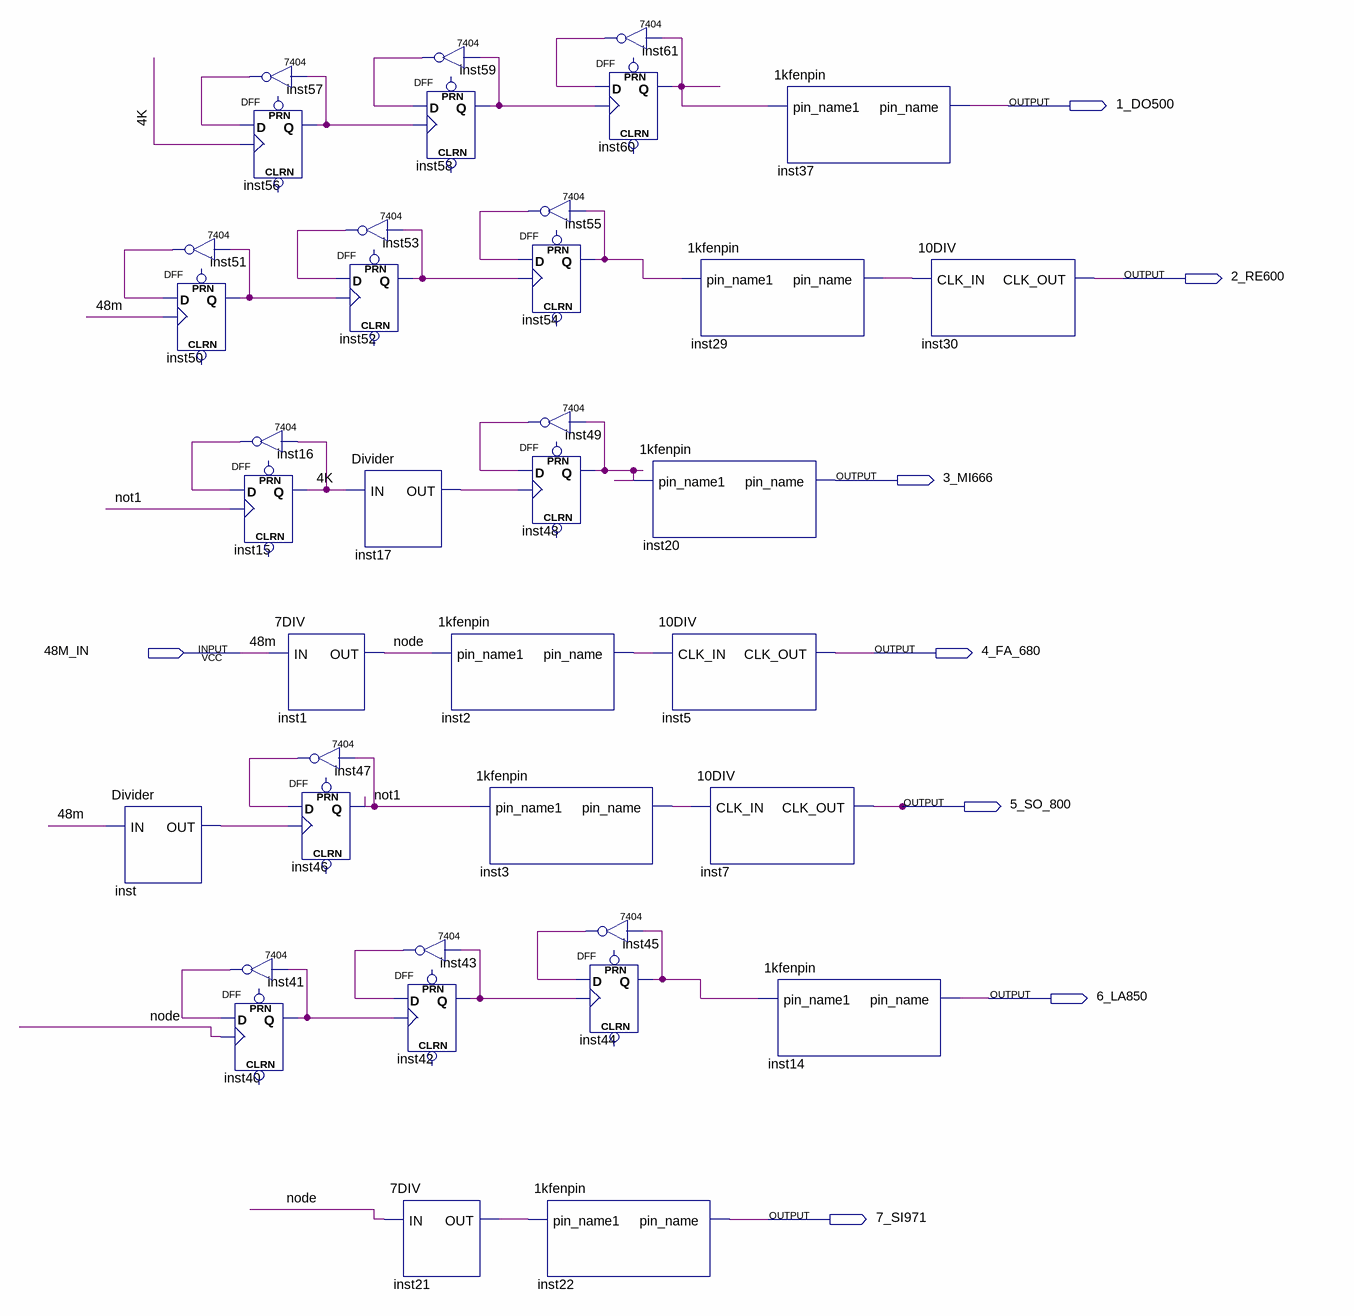
[diagram p0: schematic sheet]
// Quartus schematic MUSIC_TUNE.bdf as structural Verilog: 38 symbols, 8 pins
module MUSIC_TUNE (
  input  \48M_IN ,
  output \1_DO500 ,
  output \2_RE600 ,
  output \3_MI666 ,
  output \4_FA_680 ,
  output \5_SO_800 ,
  output \6_LA850 ,
  output \7_SI971 
);

  wire \4K , inst2_pin_name, inst3_pin_name, inst16_1, inst17_out, inst21_out, inst29_pin_name, inst40_q,
       inst41_1, inst42_q, inst43_1, inst44_q, inst45_1, inst47_1, inst48_q, inst49_1, inst50_q, inst51_1,
       inst52_q, inst53_1, inst54_q, inst55_1, inst56_q, inst57_1, inst58_q, inst59_1, inst60_q, inst61_1,
       inst_out, node, not1;

  Divider inst (.IN(\48M_IN ), .OUT(inst_out));
  \7404  inst51 (.\2 (inst50_q), .\1 (inst51_1));
  DFF inst50 (.CLK(\48M_IN ), .D(inst51_1), .Q(inst50_q));  // open: CLRN, PRN
  \7404  inst57 (.\2 (inst56_q), .\1 (inst57_1));
  DFF inst56 (.CLK(\4K ), .D(inst57_1), .Q(inst56_q));  // open: CLRN, PRN
  \7404  inst16 (.\2 (\4K ), .\1 (inst16_1));
  DFF inst15 (.CLK(not1), .D(inst16_1), .Q(\4K ));  // open: CLRN, PRN
  \7DIV  inst1 (.IN(\48M_IN ), .OUT(node));
  \7404  inst41 (.\2 (inst40_q), .\1 (inst41_1));
  DFF inst40 (.CLK(node), .D(inst41_1), .Q(inst40_q));  // open: CLRN, PRN
  \7404  inst53 (.\2 (inst52_q), .\1 (inst53_1));
  DFF inst52 (.CLK(inst50_q), .D(inst53_1), .Q(inst52_q));  // open: CLRN, PRN
  Divider inst17 (.IN(\4K ), .OUT(inst17_out));
  \7404  inst47 (.\2 (not1), .\1 (inst47_1));
  DFF inst46 (.CLK(inst_out), .D(inst47_1), .Q(not1));  // open: CLRN, PRN
  \7404  inst59 (.\2 (inst58_q), .\1 (inst59_1));
  DFF inst58 (.CLK(inst56_q), .D(inst59_1), .Q(inst58_q));  // open: CLRN, PRN
  \1kfenpin  inst2 (.pin_name1(node), .pin_name(inst2_pin_name));
  \7404  inst43 (.\2 (inst42_q), .\1 (inst43_1));
  DFF inst42 (.CLK(inst40_q), .D(inst43_1), .Q(inst42_q));  // open: CLRN, PRN
  \7DIV  inst21 (.IN(node), .OUT(inst21_out));
  \1kfenpin  inst3 (.pin_name1(not1), .pin_name(inst3_pin_name));
  \7404  inst55 (.\2 (inst54_q), .\1 (inst55_1));
  DFF inst54 (.CLK(inst52_q), .D(inst55_1), .Q(inst54_q));  // open: CLRN, PRN
  \7404  inst49 (.\2 (inst48_q), .\1 (inst49_1));
  DFF inst48 (.CLK(inst17_out), .D(inst49_1), .Q(inst48_q));  // open: CLRN, PRN
  \7404  inst45 (.\2 (inst44_q), .\1 (inst45_1));
  DFF inst44 (.CLK(inst42_q), .D(inst45_1), .Q(inst44_q));  // open: CLRN, PRN
  \1kfenpin  inst22 (.pin_name1(inst21_out), .pin_name(\7_SI971 ));
  \7404  inst61 (.\2 (inst60_q), .\1 (inst61_1));
  DFF inst60 (.CLK(inst58_q), .D(inst61_1), .Q(inst60_q));  // open: CLRN, PRN
  \1kfenpin  inst20 (.pin_name1(inst48_q), .pin_name(\3_MI666 ));
  \10DIV  inst5 (.CLK_IN(inst2_pin_name), .CLK_OUT(\4_FA_680 ));
  \1kfenpin  inst29 (.pin_name1(inst54_q), .pin_name(inst29_pin_name));
  \10DIV  inst7 (.CLK_IN(inst3_pin_name), .CLK_OUT(\5_SO_800 ));
  \1kfenpin  inst37 (.pin_name1(inst60_q), .pin_name(\1_DO500 ));
  \1kfenpin  inst14 (.pin_name1(inst44_q), .pin_name(\6_LA850 ));
  \10DIV  inst30 (.CLK_IN(inst29_pin_name), .CLK_OUT(\2_RE600 ));

  // Other names for the same wires on the sheet: 48m = \48M_IN 
endmodule
